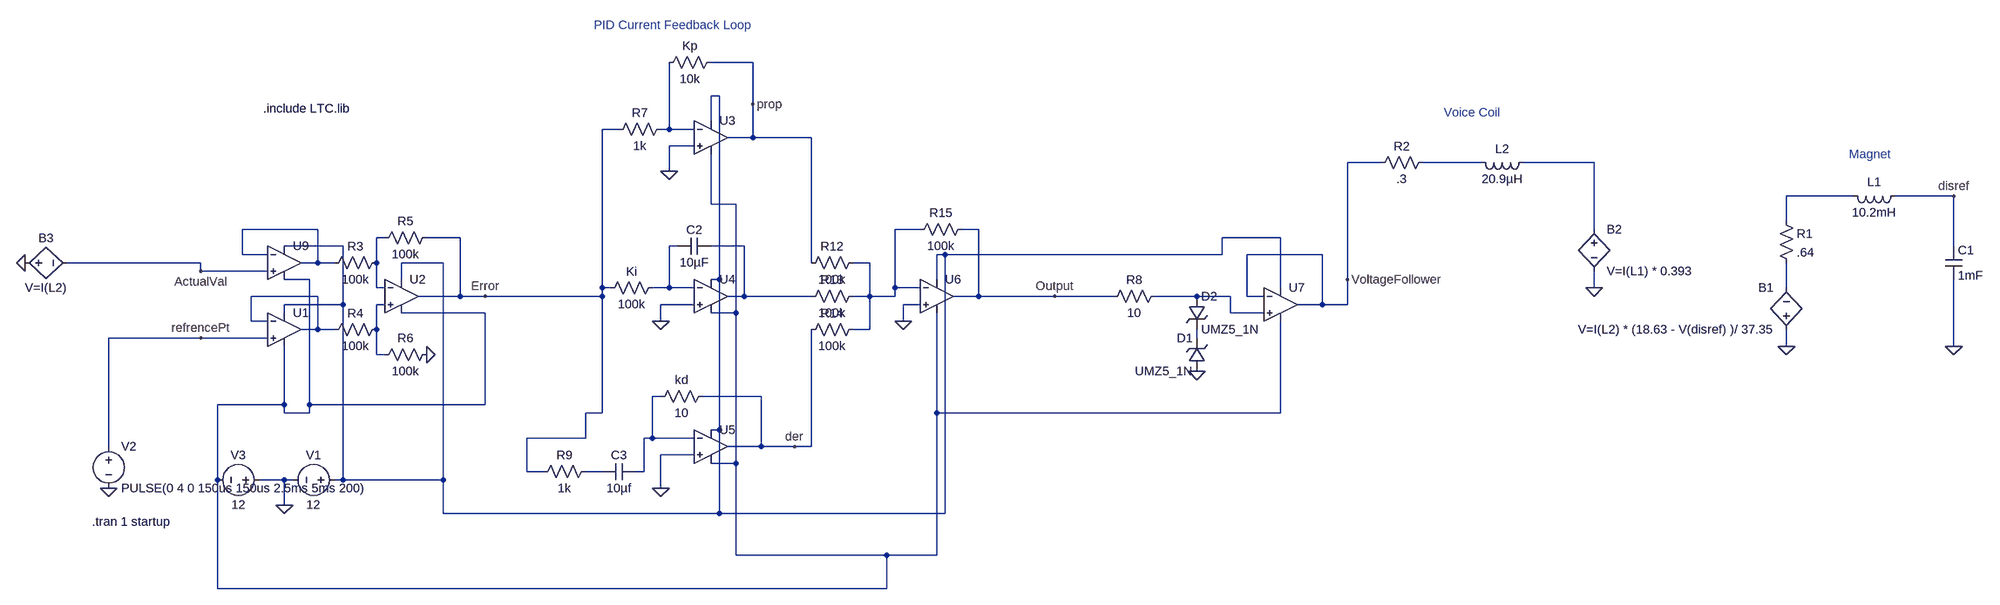
[diagram p0: schematic selectingVoltage.asc]
selectingVoltage.asc, the LTspice schematic file:
Version 4.1
SHEET 1 880 960
WIRE -2000 -240 -2080 -240
WIRE -2064 -176 -2080 -176
WIRE -2000 -160 -2000 -240
WIRE -2080 -128 -2080 -176
WIRE -2256 -112 -2288 -112
WIRE -2160 -112 -2160 -240
WIRE -2160 -112 -2176 -112
WIRE -2112 -112 -2160 -112
WIRE -2000 -96 -2000 -160
WIRE -2000 -96 -2048 -96
WIRE -1888 -96 -2000 -96
WIRE -2112 -80 -2160 -80
WIRE -640 -48 -704 -48
WIRE -448 -48 -560 -48
WIRE -224 -48 -368 -48
WIRE -2160 -32 -2160 -80
WIRE 272 16 144 16
WIRE 464 16 352 16
WIRE -2080 32 -2080 -64
WIRE -2032 32 -2080 32
WIRE 144 64 144 16
WIRE -2832 80 -2976 80
WIRE -1680 80 -1728 80
WIRE -1568 80 -1600 80
WIRE -224 80 -224 -48
WIRE -2704 96 -2720 96
WIRE -2560 96 -2624 96
WIRE -832 96 -944 96
WIRE -2784 112 -2896 112
WIRE -2144 112 -2160 112
WIRE -2016 112 -2080 112
WIRE 464 112 464 16
WIRE -2976 128 -2976 80
WIRE -2928 128 -2976 128
WIRE -1632 128 -1648 128
WIRE -944 128 -944 96
WIRE -944 128 -1632 128
WIRE -752 128 -896 128
WIRE -3056 144 -3312 144
WIRE -2832 144 -2832 80
WIRE -2832 144 -2864 144
WIRE -2800 144 -2832 144
WIRE -2720 144 -2720 96
WIRE -2592 144 -2672 144
WIRE -1888 144 -1888 -96
WIRE -1776 144 -1808 144
WIRE -3056 160 -3056 144
WIRE -2928 160 -3056 160
WIRE -2848 176 -2896 176
WIRE -2672 176 -2672 144
WIRE -2064 176 -2064 -176
WIRE -2064 176 -2080 176
WIRE -1648 176 -1648 128
WIRE -704 176 -704 -48
WIRE -2720 192 -2720 144
WIRE -2704 192 -2720 192
WIRE -2288 192 -2288 -112
WIRE -2272 192 -2288 192
WIRE -2160 192 -2160 112
WIRE -2160 192 -2192 192
WIRE -2112 192 -2160 192
WIRE -1728 192 -1728 80
WIRE -1680 192 -1728 192
WIRE -832 192 -832 96
WIRE -224 192 -224 160
WIRE 144 192 144 144
WIRE -2832 208 -2960 208
WIRE -2560 208 -2560 96
WIRE -2560 208 -2640 208
WIRE -2512 208 -2560 208
WIRE -2288 208 -2288 192
WIRE -2288 208 -2512 208
WIRE -2016 208 -2016 112
WIRE -2016 208 -2048 208
WIRE -1888 208 -2016 208
WIRE -1776 208 -1776 144
WIRE -1776 208 -1808 208
WIRE -1728 208 -1728 192
WIRE -1728 208 -1776 208
WIRE -1568 208 -1568 80
WIRE -1568 208 -1616 208
WIRE -1264 208 -1568 208
WIRE -1152 208 -1264 208
WIRE -992 208 -1072 208
WIRE -928 208 -992 208
WIRE -896 208 -896 128
WIRE -864 208 -896 208
WIRE -2784 224 -2784 112
WIRE -2784 224 -2896 224
WIRE -2704 224 -2720 224
WIRE -2112 224 -2176 224
WIRE -1680 224 -1712 224
WIRE -752 224 -752 128
WIRE -752 224 -800 224
WIRE -704 224 -704 176
WIRE -704 224 -752 224
WIRE -2896 240 -2896 224
WIRE -2512 240 -2672 240
WIRE -2032 240 -2032 32
WIRE -2032 240 -2080 240
WIRE -928 240 -928 208
WIRE -864 240 -928 240
WIRE -2960 256 -2960 208
WIRE -2928 256 -2960 256
WIRE -2176 256 -2176 224
WIRE -1712 256 -1712 224
WIRE -2832 272 -2832 208
WIRE -2832 272 -2864 272
WIRE -2800 272 -2832 272
WIRE -2720 272 -2720 224
WIRE -1776 272 -1776 208
WIRE -1776 272 -1808 272
WIRE -3056 288 -3232 288
WIRE -2928 288 -3056 288
WIRE -992 288 -992 272
WIRE 144 304 144 272
WIRE 464 304 464 176
WIRE -2720 320 -2720 272
WIRE -2704 320 -2720 320
WIRE -2176 400 -2192 400
WIRE -1984 400 -2096 400
WIRE -2896 416 -2896 304
WIRE -2896 416 -3024 416
WIRE -2848 416 -2848 176
WIRE -2512 416 -2512 240
WIRE -2512 416 -2848 416
WIRE -2896 432 -2896 416
WIRE -2848 432 -2848 416
WIRE -2848 432 -2896 432
WIRE -2288 432 -2288 208
WIRE -2288 432 -2320 432
WIRE -1648 432 -1648 240
WIRE -832 432 -832 256
WIRE -832 432 -1648 432
WIRE -2064 464 -2064 176
WIRE -2064 464 -2080 464
WIRE -2320 480 -2320 432
WIRE -2320 480 -2432 480
WIRE -2192 480 -2192 400
WIRE -2192 480 -2208 480
WIRE -2112 480 -2192 480
WIRE -3232 496 -3232 288
WIRE -1984 496 -1984 400
WIRE -1984 496 -2048 496
WIRE -1920 496 -1984 496
WIRE -1888 496 -1888 272
WIRE -1888 496 -1920 496
WIRE -2112 512 -2176 512
WIRE -2032 528 -2032 240
WIRE -2032 528 -2080 528
WIRE -2432 544 -2432 480
WIRE -2400 544 -2432 544
WIRE -2288 544 -2320 544
WIRE -2208 544 -2208 480
WIRE -2208 544 -2224 544
WIRE -3024 560 -3024 416
WIRE -2896 560 -2944 560
WIRE -2880 560 -2896 560
WIRE -2784 560 -2784 224
WIRE -2784 560 -2800 560
WIRE -2592 560 -2592 144
WIRE -2592 560 -2784 560
WIRE -2176 576 -2176 512
WIRE -2896 608 -2896 560
WIRE -2592 624 -2592 560
WIRE -2064 624 -2064 464
WIRE -2064 624 -2592 624
WIRE -1632 624 -1632 128
WIRE -1632 624 -2064 624
WIRE -2032 704 -2032 528
WIRE -1744 704 -2032 704
WIRE -1648 704 -1648 432
WIRE -1648 704 -1744 704
WIRE -3024 768 -3024 560
WIRE -1744 768 -1744 704
WIRE -1744 768 -3024 768
FLAG 144 304 0
FLAG 464 304 0
FLAG -224 192 0
FLAG -2624 320 0
FLAG -3056 288 refrencePt
FLAG -3056 160 ActualVal
FLAG -2512 208 Error
FLAG -2160 -32 0
FLAG -2176 256 0
FLAG -2176 576 0
FLAG -1712 256 0
FLAG -3232 576 0
FLAG -2896 608 0
FLAG -1264 208 Output
FLAG -992 352 0
FLAG -2000 -160 prop
FLAG -1920 496 der
FLAG -3392 144 0
FLAG -704 176 VoltageFollower
FLAG 464 16 disref
SYMBOL bv 144 288 R180
WINDOW 0 24 96 Left 2
WINDOW 3 24 16 Left 2
SYMATTR InstName B1
SYMATTR Value V=I(L2) * (18.63 - V(disref) )/ 37.35
SYMBOL res 128 48 R0
SYMATTR InstName R1
SYMATTR Value .64
SYMBOL ind 368 0 R90
WINDOW 0 5 56 VBottom 2
WINDOW 3 32 56 VTop 2
SYMATTR InstName L1
SYMATTR Value 10.2mH
SYMATTR SpiceLine Rser=1m
SYMBOL cap 448 112 R0
SYMATTR InstName C1
SYMATTR Value 1mF
SYMBOL bv -224 64 R0
SYMATTR InstName B2
SYMATTR Value V=I(L1) * 0.393
SYMBOL ind -352 -64 R90
WINDOW 0 5 56 VBottom 2
WINDOW 3 32 56 VTop 2
SYMATTR InstName L2
SYMATTR Value 20.9µH
SYMATTR SpiceLine Rser=1m
SYMBOL res -544 -64 R90
WINDOW 0 0 56 VBottom 2
WINDOW 3 32 56 VTop 2
SYMATTR InstName R2
SYMATTR Value .3
SYMBOL voltage -2784 560 R90
WINDOW 0 -32 56 VBottom 2
WINDOW 3 32 56 VTop 2
WINDOW 123 0 0 Left 0
WINDOW 39 0 0 Left 0
SYMATTR InstName V1
SYMATTR Value 12
SYMBOL res -2704 128 R90
WINDOW 0 0 56 VBottom 2
WINDOW 3 32 56 VTop 2
SYMATTR InstName R3
SYMATTR Value 100k
SYMBOL res -2704 256 R90
WINDOW 0 0 56 VBottom 2
WINDOW 3 32 56 VTop 2
SYMATTR InstName R4
SYMATTR Value 100k
SYMBOL res -2608 80 R90
WINDOW 0 0 56 VBottom 2
WINDOW 3 32 56 VTop 2
SYMATTR InstName R5
SYMATTR Value 100k
SYMBOL res -2608 304 R90
WINDOW 0 0 56 VBottom 2
WINDOW 3 32 56 VTop 2
SYMATTR InstName R6
SYMATTR Value 100k
SYMBOL res -2160 -128 R90
WINDOW 0 0 56 VBottom 2
WINDOW 3 32 56 VTop 2
SYMATTR InstName R7
SYMATTR Value 1k
SYMBOL res -2176 176 R90
WINDOW 0 0 56 VBottom 2
WINDOW 3 32 56 VTop 2
SYMATTR InstName Ki
SYMATTR Value 100k
SYMBOL res -2304 528 R90
WINDOW 0 0 56 VBottom 2
WINDOW 3 32 56 VTop 2
SYMATTR InstName R9
SYMATTR Value 1k
SYMBOL cap -2080 96 R90
WINDOW 0 0 32 VBottom 2
WINDOW 3 32 32 VTop 2
SYMATTR InstName C2
SYMATTR Value 10µF
SYMBOL res -2064 -256 R90
WINDOW 0 0 56 VBottom 2
WINDOW 3 32 56 VTop 2
SYMATTR InstName Kp
SYMATTR Value 10k
SYMBOL res -2080 384 R90
WINDOW 0 0 56 VBottom 2
WINDOW 3 32 56 VTop 2
SYMATTR InstName kd
SYMATTR Value 10
SYMBOL res -1792 128 R90
WINDOW 0 0 56 VBottom 2
WINDOW 3 32 56 VTop 2
SYMATTR InstName R12
SYMATTR Value 100k
SYMBOL res -1792 192 R90
WINDOW 0 0 56 VBottom 2
WINDOW 3 32 56 VTop 2
SYMATTR InstName R13
SYMATTR Value 100k
SYMBOL res -1792 256 R90
WINDOW 0 0 56 VBottom 2
WINDOW 3 32 56 VTop 2
SYMATTR InstName R14
SYMATTR Value 100k
SYMBOL res -1584 64 R90
WINDOW 0 0 56 VBottom 2
WINDOW 3 32 56 VTop 2
SYMATTR InstName R15
SYMATTR Value 100k
SYMBOL cap -2224 528 R90
WINDOW 0 0 32 VBottom 2
WINDOW 3 32 32 VTop 2
SYMATTR InstName C3
SYMATTR Value 10µf
SYMBOL voltage -3232 480 R0
WINDOW 123 0 0 Left 0
WINDOW 39 0 0 Left 0
SYMATTR InstName V2
SYMATTR Value PULSE(0 4 0 150us 150us 2.5ms 5ms 200)
SYMBOL OpAmps\\UniversalOpAmp -2896 144 R0
SYMATTR InstName U9
SYMBOL OpAmps\\UniversalOpAmp -2896 272 R0
SYMATTR InstName U1
SYMBOL OpAmps\\UniversalOpAmp -2672 208 R0
SYMATTR InstName U2
SYMBOL OpAmps\\UniversalOpAmp -2080 -96 R0
SYMATTR InstName U3
SYMBOL OpAmps\\UniversalOpAmp -2080 208 R0
SYMATTR InstName U4
SYMBOL OpAmps\\UniversalOpAmp -2080 496 R0
SYMATTR InstName U5
SYMBOL OpAmps\\UniversalOpAmp -1648 208 R0
SYMATTR InstName U6
SYMBOL voltage -2928 560 R90
WINDOW 0 -32 56 VBottom 2
WINDOW 3 32 56 VTop 2
WINDOW 123 0 0 Left 0
WINDOW 39 0 0 Left 0
SYMATTR InstName V3
SYMATTR Value 12
SYMBOL zener -976 352 R180
WINDOW 0 24 64 Left 2
WINDOW 3 24 0 Left 2
SYMATTR InstName D1
SYMATTR Value UMZ5_1N
SYMBOL res -1056 192 R90
WINDOW 0 0 56 VBottom 2
WINDOW 3 32 56 VTop 2
SYMATTR InstName R8
SYMATTR Value 10
SYMBOL OpAmps\\UniversalOpAmp -832 224 R0
SYMATTR InstName U7
SYMBOL zener -1008 208 R0
SYMATTR InstName D2
SYMATTR Value UMZ5_1N
SYMBOL bv -3408 144 R270
WINDOW 0 32 56 VTop 2
WINDOW 3 -32 56 VBottom 2
SYMATTR InstName B3
SYMATTR Value V=I(L2)
TEXT -3264 640 Left 2 !.tran 1 startup
TEXT -2936 -152 Left 2 !.include LTC.lib
TEXT 264 -64 Left 2 ;Magnet
TEXT -520 -144 Left 2 ;Voice Coil
TEXT -2304 -312 Left 2 ;PID Current Feedback Loop

The netlist it stands for:
* selectingVoltage.asc
B1 0 N012 V=I(L2) * (18.63 - V(disref) )/ 37.35
R1 N005 N012 .64
L1 disref N005 10.2mH Rser=1m
C1 disref 0 1mF
B2 N004 0 V=I(L1) * 0.393
L2 N004 N003 20.9µH Rser=1m
R2 N003 VoltageFollower .3
V1 N001 0 12
R3 N009 N007 100k
R4 N015 N013 100k
R5 Error N009 100k
R6 0 N015 100k
R7 N002 Error 1k
R§Ki N010 Error 100k
R9 N018 Error 1k
C2 N011 N010 10µF
R§Kp prop N002 10k
R§kd der N017 10
R12 N008 prop 100k
R13 N008 N011 100k
R14 N008 der 100k
R15 Output N008 100k
C3 N017 N018 10µf
V2 refrencePt 0 PULSE(0 4 0 150us 150us 2.5ms 5ms 200)
X§U9 ActualVal N007 N001 N006 N007 level1 Avol=1Meg GBW=10Meg Vos=0 En=0 Enk=0 In=0 Ink=0 Rin=500Meg  ; pins In+ In- V+ V- OUT
X§U1 refrencePt N013 N001 N006 N013 level1 Avol=1Meg GBW=10Meg Vos=0 En=0 Enk=0 In=0 Ink=0 Rin=500Meg  ; pins In+ In- V+ V- OUT
X§U2 N015 N009 N001 N006 Error level1 Avol=1Meg GBW=10Meg Vos=0 En=0 Enk=0 In=0 Ink=0 Rin=500Meg  ; pins In+ In- V+ V- OUT
X§U3 0 N002 N001 N006 prop level1 Avol=1Meg GBW=10Meg Vos=0 En=0 Enk=0 In=0 Ink=0 Rin=500Meg  ; pins In+ In- V+ V- OUT
X§U4 0 N010 N001 N006 N011 level1 Avol=1Meg GBW=10Meg Vos=0 En=0 Enk=0 In=0 Ink=0 Rin=500Meg  ; pins In+ In- V+ V- OUT
X§U5 0 N017 N001 N006 der level1 Avol=1Meg GBW=10Meg Vos=0 En=0 Enk=0 In=0 Ink=0 Rin=500Meg  ; pins In+ In- V+ V- OUT
X§U6 0 N008 N001 N006 Output level1 Avol=1Meg GBW=10Meg Vos=0 En=0 Enk=0 In=0 Ink=0 Rin=500Meg  ; pins In+ In- V+ V- OUT
V3 0 N006 12
D1 0 N016 UMZ5_1N
R8 N014 Output 10
X§U7 N014 VoltageFollower N001 N006 VoltageFollower level1 Avol=1Meg GBW=10Meg Vos=0 En=0 Enk=0 In=0 Ink=0 Rin=500Meg  ; pins In+ In- V+ V- OUT
D2 N014 N016 UMZ5_1N
B3 0 ActualVal V=I(L2)
.model D D
.lib standard.dio
.tran 1 startup
.include LTC.lib
* Magnet
* Voice Coil
* PID Current Feedback Loop
.lib UniversalOpAmp1.lib
.backanno
.end